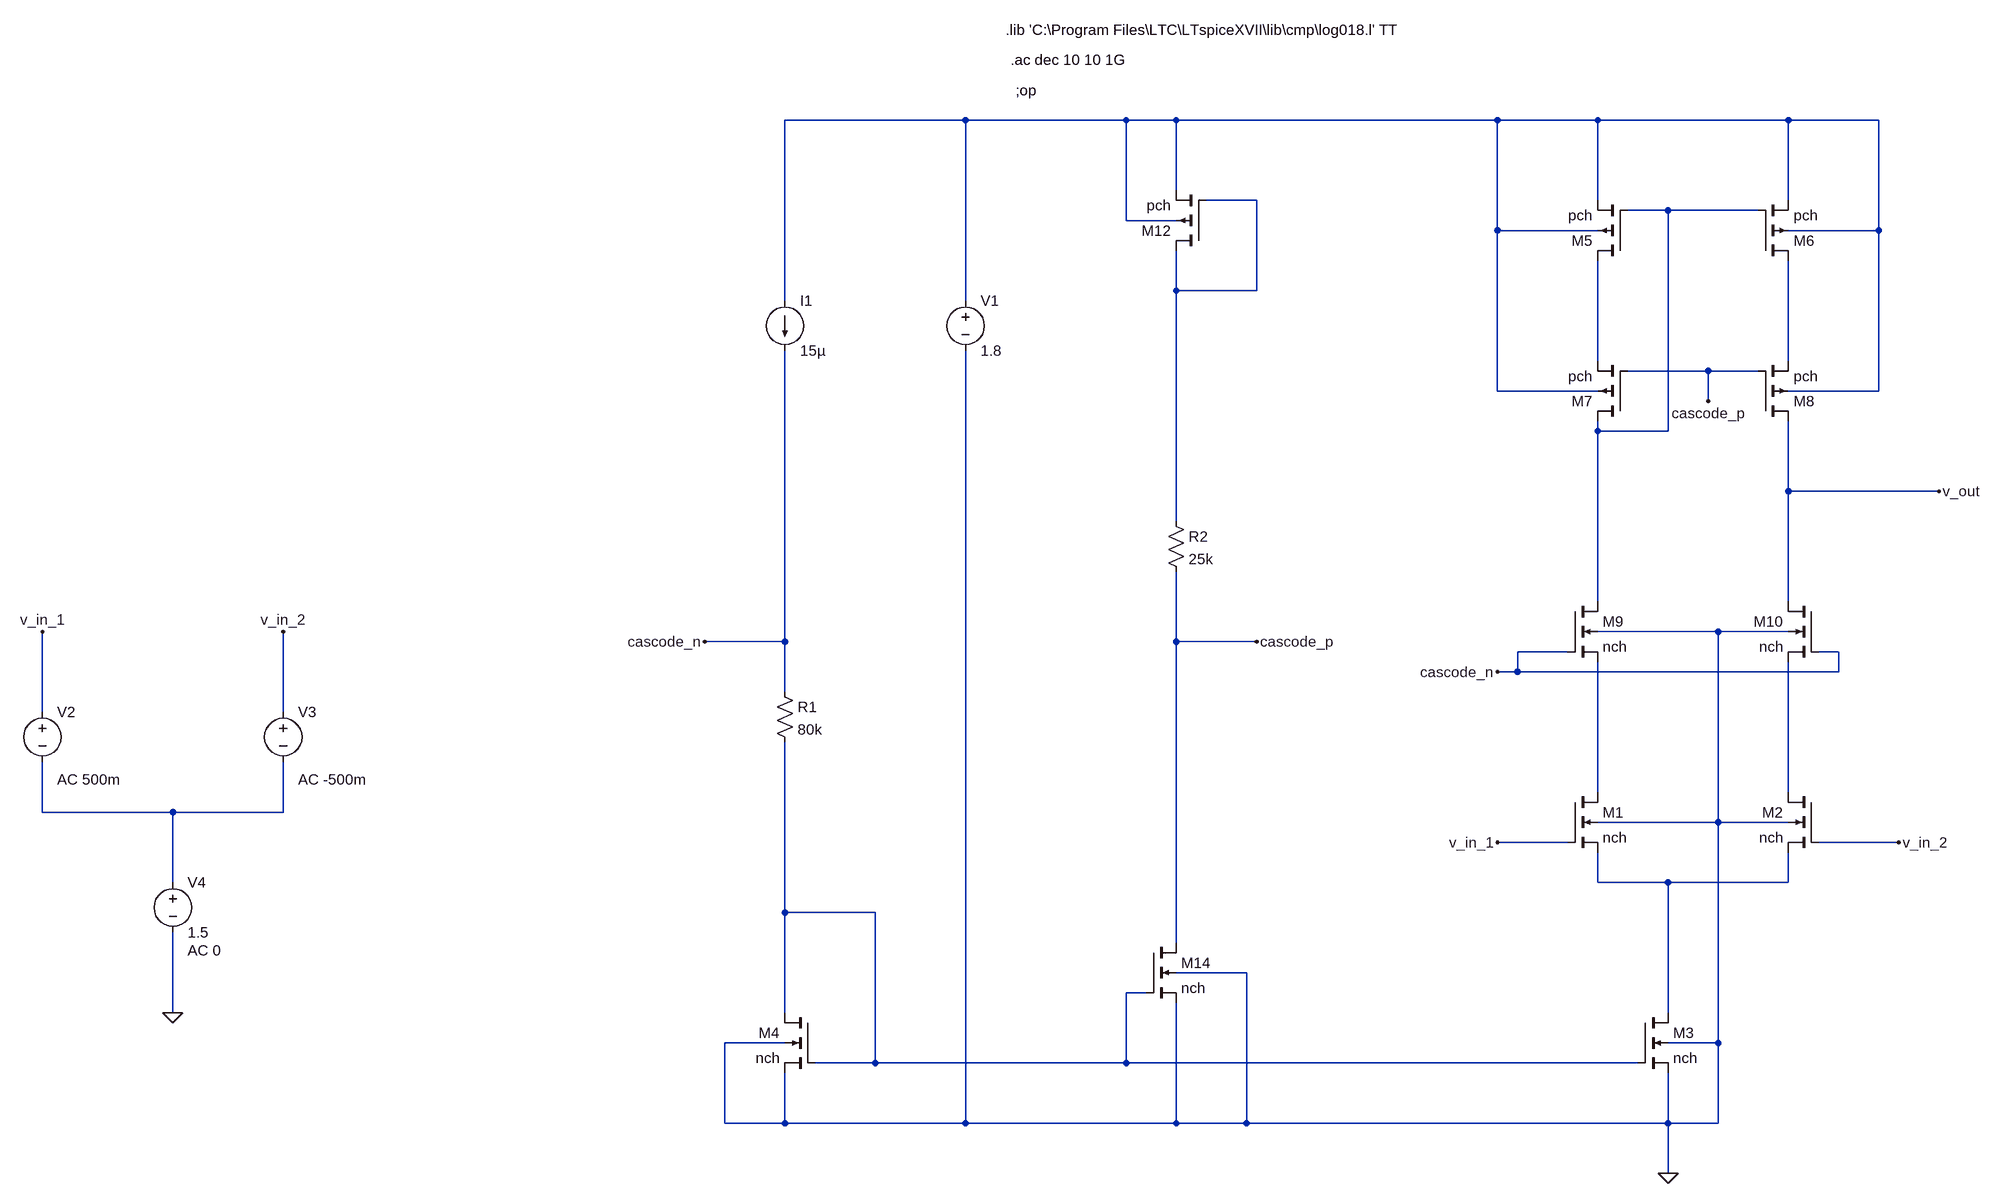
[diagram p0: schematic differential-pair-current-mirror.asc]
differential-pair-current-mirror.asc, the LTspice schematic file:
Version 4
SHEET 1 1744 1748
WIRE -400 48 -688 48
WIRE -144 48 -400 48
WIRE -64 48 -144 48
WIRE 448 48 -64 48
WIRE 608 48 448 48
WIRE 912 48 608 48
WIRE 1056 48 912 48
WIRE -64 160 -64 48
WIRE 64 176 -16 176
WIRE 608 176 608 48
WIRE 912 176 912 48
WIRE 720 192 656 192
WIRE 864 192 720 192
WIRE -144 208 -144 48
WIRE -64 208 -144 208
WIRE 448 224 448 48
WIRE 608 224 448 224
WIRE 1056 224 1056 48
WIRE 1056 224 912 224
WIRE -64 320 -64 256
WIRE 64 320 64 176
WIRE 64 320 -64 320
WIRE -688 336 -688 48
WIRE -400 336 -400 48
WIRE 608 432 608 272
WIRE 912 432 912 272
WIRE 784 448 656 448
WIRE 864 448 784 448
WIRE 448 480 448 224
WIRE 608 480 448 480
WIRE 1056 480 1056 224
WIRE 1056 480 912 480
WIRE 784 496 784 448
WIRE 608 544 608 528
WIRE 720 544 720 192
WIRE 720 544 608 544
WIRE 912 640 912 528
WIRE 1152 640 912 640
WIRE -64 688 -64 320
WIRE 608 816 608 544
WIRE 912 816 912 640
WIRE 800 864 608 864
WIRE 912 864 800 864
WIRE -688 880 -688 416
WIRE -688 880 -816 880
WIRE -64 880 -64 768
WIRE 64 880 -64 880
WIRE 560 896 480 896
WIRE 992 896 960 896
WIRE 480 928 480 896
WIRE 480 928 448 928
WIRE 992 928 992 896
WIRE 992 928 480 928
WIRE -688 960 -688 880
WIRE -1872 992 -1872 864
WIRE -1488 992 -1488 864
WIRE 608 1120 608 912
WIRE 912 1120 912 912
WIRE -1872 1152 -1872 1072
WIRE -1664 1152 -1872 1152
WIRE -1488 1152 -1488 1072
WIRE -1488 1152 -1664 1152
WIRE 800 1168 800 864
WIRE 800 1168 608 1168
WIRE 912 1168 800 1168
WIRE 560 1200 448 1200
WIRE 1088 1200 960 1200
WIRE -1664 1264 -1664 1152
WIRE 608 1264 608 1216
WIRE 720 1264 608 1264
WIRE 912 1264 912 1216
WIRE 912 1264 720 1264
WIRE -688 1312 -688 1040
WIRE -544 1312 -688 1312
WIRE -64 1360 -64 880
WIRE 48 1408 -64 1408
WIRE -112 1440 -144 1440
WIRE -1664 1472 -1664 1344
WIRE -688 1472 -688 1312
WIRE 720 1472 720 1264
WIRE -688 1520 -784 1520
WIRE 800 1520 800 1168
WIRE 800 1520 720 1520
WIRE -544 1552 -544 1312
WIRE -544 1552 -640 1552
WIRE -144 1552 -144 1440
WIRE -144 1552 -544 1552
WIRE 672 1552 -144 1552
WIRE -784 1648 -784 1520
WIRE -688 1648 -688 1568
WIRE -688 1648 -784 1648
WIRE -400 1648 -400 416
WIRE -400 1648 -688 1648
WIRE -64 1648 -64 1456
WIRE -64 1648 -400 1648
WIRE 48 1648 48 1408
WIRE 48 1648 -64 1648
WIRE 720 1648 720 1568
WIRE 720 1648 48 1648
WIRE 800 1648 800 1520
WIRE 800 1648 720 1648
WIRE 720 1728 720 1648
FLAG 720 1728 0
FLAG -1664 1472 0
FLAG 448 1200 v_in_1
FLAG 1088 1200 v_in_2
FLAG -1872 864 v_in_1
FLAG -1488 864 v_in_2
FLAG 1152 640 v_out
FLAG 784 496 cascode_p
FLAG 448 928 cascode_n
FLAG -816 880 cascode_n
FLAG 64 880 cascode_p
SYMBOL nmos4 560 1120 R0
SYMATTR InstName M1
SYMATTR Value nch
SYMATTR Value2 l=1u w=15u
SYMBOL nmos4 960 1120 M0
SYMATTR InstName M2
SYMATTR Value nch
SYMATTR Value2 l=1u w=15u
SYMBOL nmos4 672 1472 R0
SYMATTR InstName M3
SYMATTR Value nch
SYMATTR Value2 l=1u w=30u
SYMBOL nmos4 -640 1472 M0
SYMATTR InstName M4
SYMATTR Value nch
SYMATTR Value2 l=1u w=15u
SYMBOL pmos4 656 272 R180
SYMATTR InstName M5
SYMATTR Value pch
SYMATTR Value2 l=1u w=30u
SYMBOL pmos4 864 272 M180
SYMATTR InstName M6
SYMATTR Value pch
SYMATTR Value2 l=1u w=30u
SYMBOL current -688 336 R0
SYMATTR InstName I1
SYMATTR Value 15µ
SYMBOL voltage -400 320 R0
WINDOW 123 0 0 Left 0
WINDOW 39 0 0 Left 0
SYMATTR InstName V1
SYMATTR Value 1.8
SYMBOL voltage -1872 976 R0
WINDOW 123 24 124 Left 2
WINDOW 39 0 0 Left 0
SYMATTR Value2 AC 500m
SYMATTR InstName V2
SYMATTR Value ""
SYMBOL voltage -1664 1248 R0
WINDOW 123 24 124 Left 2
WINDOW 39 0 0 Left 0
SYMATTR Value2 AC 0
SYMATTR InstName V4
SYMATTR Value 1.5
SYMBOL voltage -1488 976 R0
WINDOW 123 24 124 Left 2
WINDOW 39 0 0 Left 0
SYMATTR Value2 AC -500m
SYMATTR InstName V3
SYMATTR Value ""
SYMBOL pmos4 656 528 R180
SYMATTR InstName M7
SYMATTR Value pch
SYMATTR Value2 l=1u w=30u
SYMBOL pmos4 864 528 M180
SYMATTR InstName M8
SYMATTR Value pch
SYMATTR Value2 l=1u w=30u
SYMBOL nmos4 560 816 R0
SYMATTR InstName M9
SYMATTR Value nch
SYMATTR Value2 l=1u w=15u
SYMBOL nmos4 960 816 M0
SYMATTR InstName M10
SYMATTR Value nch
SYMATTR Value2 l=1u w=15u
SYMBOL pmos4 -16 256 R180
SYMATTR InstName M12
SYMATTR Value pch
SYMATTR Value2 l=1u w=30u
SYMBOL nmos4 -112 1360 R0
SYMATTR InstName M14
SYMATTR Value nch
SYMATTR Value2 l=1u w=15u
SYMBOL res -704 944 R0
SYMATTR InstName R1
SYMATTR Value 80k
SYMBOL res -80 672 R0
SYMATTR InstName R2
SYMATTR Value 25k
TEXT -336 -96 Left 2 !.lib 'C:\\Program Files\\LTC\\LTspiceXVII\\lib\\cmp\\log018.l' TT
TEXT -328 -48 Left 2 !.ac dec 10 10 1G
TEXT -320 0 Left 2 !;op

The netlist it stands for:
* differential-pair-current-mirror.asc
M1 N006 v_in_1 N009 0 nch l=1u w=15u
M2 N007 v_in_2 N009 0 nch l=1u w=15u
M3 N009 N010 0 0 nch l=1u w=30u
M4 N010 N010 0 0 nch l=1u w=15u
M5 N004 N003 N001 N001 pch l=1u w=30u
M6 N005 N003 N001 N001 pch l=1u w=30u
I1 N001 cascode_n 15µ
V1 N001 0 1.8
V2 v_in_1 N008 AC 500m
V4 N008 0 1.5 AC 0
V3 v_in_2 N008 AC -500m
M7 N003 cascode_p N004 N001 pch l=1u w=30u
M8 v_out cascode_p N005 N001 pch l=1u w=30u
M9 N003 cascode_n N006 0 nch l=1u w=15u
M10 v_out cascode_n N007 0 nch l=1u w=15u
M12 N002 N002 N001 N001 pch l=1u w=30u
M14 cascode_p N010 0 0 nch l=1u w=15u
R1 cascode_n N010 80k
R2 N002 cascode_p 25k
.model NMOS NMOS
.model PMOS PMOS
.lib standard.mos
.lib 'C:\Program Files\LTC\LTspiceXVII\lib\cmp\log018.l' TT
.ac dec 10 10 1G
;op
.backanno
.end